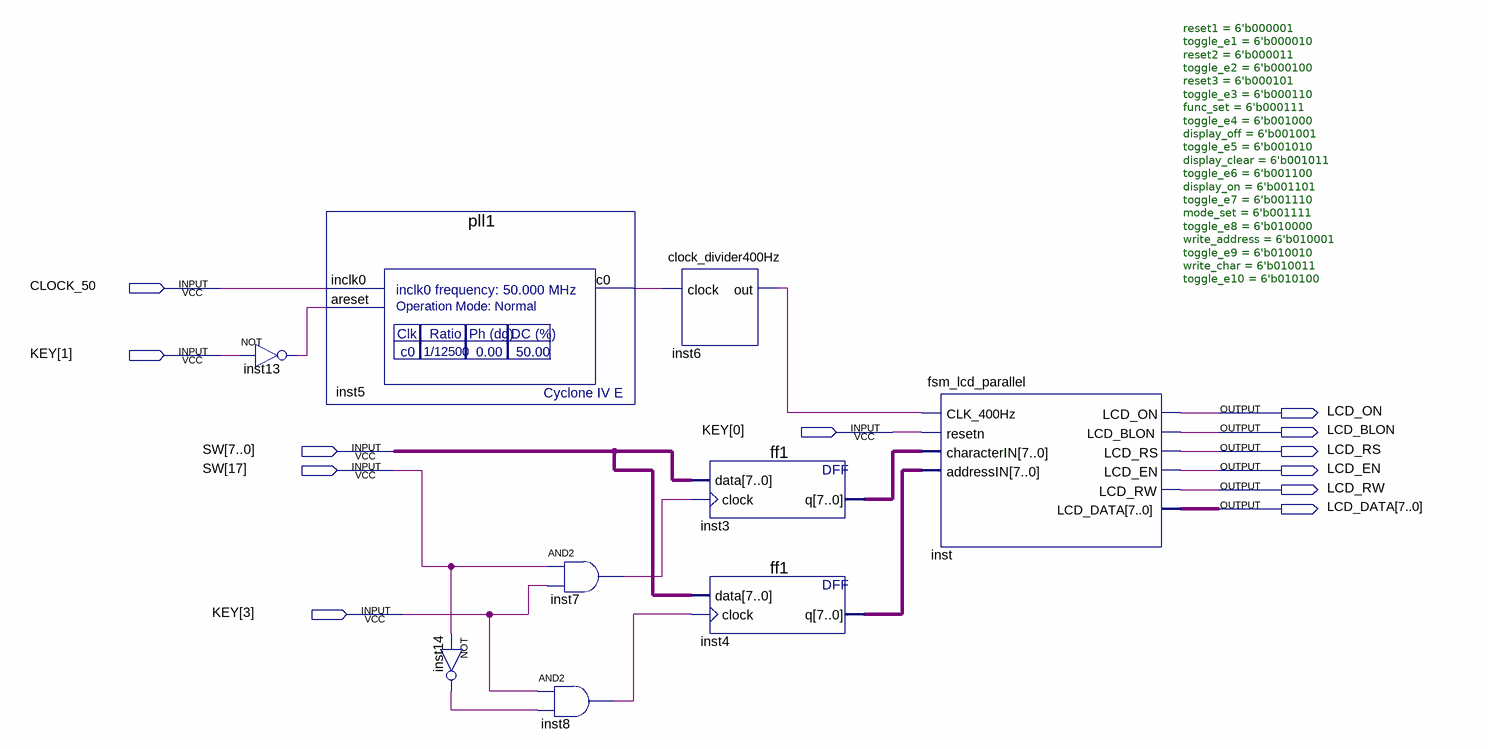
[diagram p0: schematic sheet]
// Quartus schematic lcd_parallel.bdf as structural Verilog: 9 symbols, 12 pins
module lcd_parallel (
  input  CLOCK_50,
  input  [3:0] KEY,
  input  [17:0] SW,
  output LCD_ON,
  output LCD_BLON,
  output LCD_RS,
  output LCD_EN,
  output LCD_RW,
  output [7:0] LCD_DATA
);

  wire inst5_c0, inst6_out, inst7_out, inst8_out, inst13_out, inst14_out;
  wire [7:0] inst3_q, inst4_q;

  not inst13 (inst13_out, KEY[1]);
  pll1 inst5 (.inclk0(CLOCK_50), .areset(inst13_out), .c0(inst5_c0));
  not inst14 (inst14_out, SW[17]);
  and inst8 (inst8_out, KEY[3], inst14_out);
  and inst7 (inst7_out, SW[17], KEY[3]);
  clock_divider400Hz inst6 (.clock(inst5_c0), .out(inst6_out));
  ff1 inst3 (.data(SW[7:0]), .clock(inst7_out), .q(inst3_q));
  ff1 inst4 (.data(SW[7:0]), .clock(inst8_out), .q(inst4_q));
  fsm_lcd_parallel #(.reset1(6'b000001), .toggle_e1(6'b000010), .reset2(6'b000011), .toggle_e2(6'b000100), .reset3(6'b000101), .toggle_e3(6'b000110), .func_set(6'b000111), .toggle_e4(6'b001000), .display_off(6'b001001), .toggle_e5(6'b001010), .display_clear(6'b001011), .toggle_e6(6'b001100), .display_on(6'b001101), .toggle_e7(6'b001110), .mode_set(6'b001111), .toggle_e8(6'b010000), .write_address(6'b010001), .toggle_e9(6'b010010), .write_char(6'b010011), .toggle_e10(6'b010100)) inst (
    .CLK_400Hz(inst6_out), .resetn(KEY[0]), .characterIN(inst3_q), .addressIN(inst4_q), .LCD_ON(LCD_ON),
    .LCD_BLON(LCD_BLON), .LCD_RS(LCD_RS), .LCD_EN(LCD_EN), .LCD_RW(LCD_RW), .LCD_DATA(LCD_DATA));
endmodule
